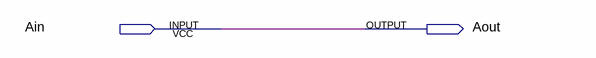
[diagram p0: schematic sheet]
// Quartus schematic SameBit.bdf as structural Verilog: 0 symbols, 2 pins
module SameBit (
  input  Ain,
  output Aout
);


  assign Aout = Ain;
endmodule
